# Altium project power.PrjPCB
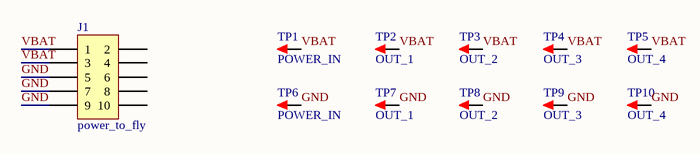
[diagram p0: power.SchDoc]
1 sheet, 11 parts. Net scope: global (net labels, ports and power ports of the same name join across sheets).
Board file: power.PcbDoc

## Sheet power.SchDoc: MyFlyPower
size A4; Author: XueDong; Organization: Altium Limited; Address1: L3, 12a Rodborough Rd; Address2: Frenchs Forest; Address3: NSW; Address4: Australia 2086; DocumentNumber: 1; Revision: V1.0; SheetNumber: 1; SheetTotal: 1

### Parts
J1  power_to_fly  [HDR1.27 2x5-M-SMD]
TP1  POWER_IN  [test_2]
TP2  OUT_1  [test_1]
TP3  OUT_2  [test_1]
TP4  OUT_3  [test_1]
TP5  OUT_4  [test_1]
TP6  POWER_IN  [test_2]
TP7  OUT_1  [test_1]
TP8  OUT_2  [test_1]
TP9  OUT_3  [test_1]
TP10  OUT_4  [test_1]

### Nets
GND: J1.5 J1.7 J1.9 TP6.1 TP7.1 TP8.1 TP9.1 TP10.1
VBAT: J1.1 J1.3 TP1.1 TP2.1 TP3.1 TP4.1 TP5.1

Not connected (* = marked no-connect by the designer): J1 2 4 6 8 10

### Notes on the sheet
- Title:
- Size:  A4
- Number:
- Revision:
- Date:
- Time:
- Sheet     of
- File:
- Author:

### Library data of the parts
J1 = Header_2x5: 2x5P-接插件; Manufacturer_Part_Number: 826656-5; Vendor: TE Connectivity; Built_By: EMA_UL_Team; C: Copyright (C) 2015 Accelerated Designs. All rights reserved; RefDes: RefDes; Type: DEV; Value: Value
TP1-TP10 = TEST: 测试点; 版权归属: 源创客; BOM名称: 测试点; 学习资源: www.ooocke.com